# EAGLE design pmu (EAGLE 7.1.0)
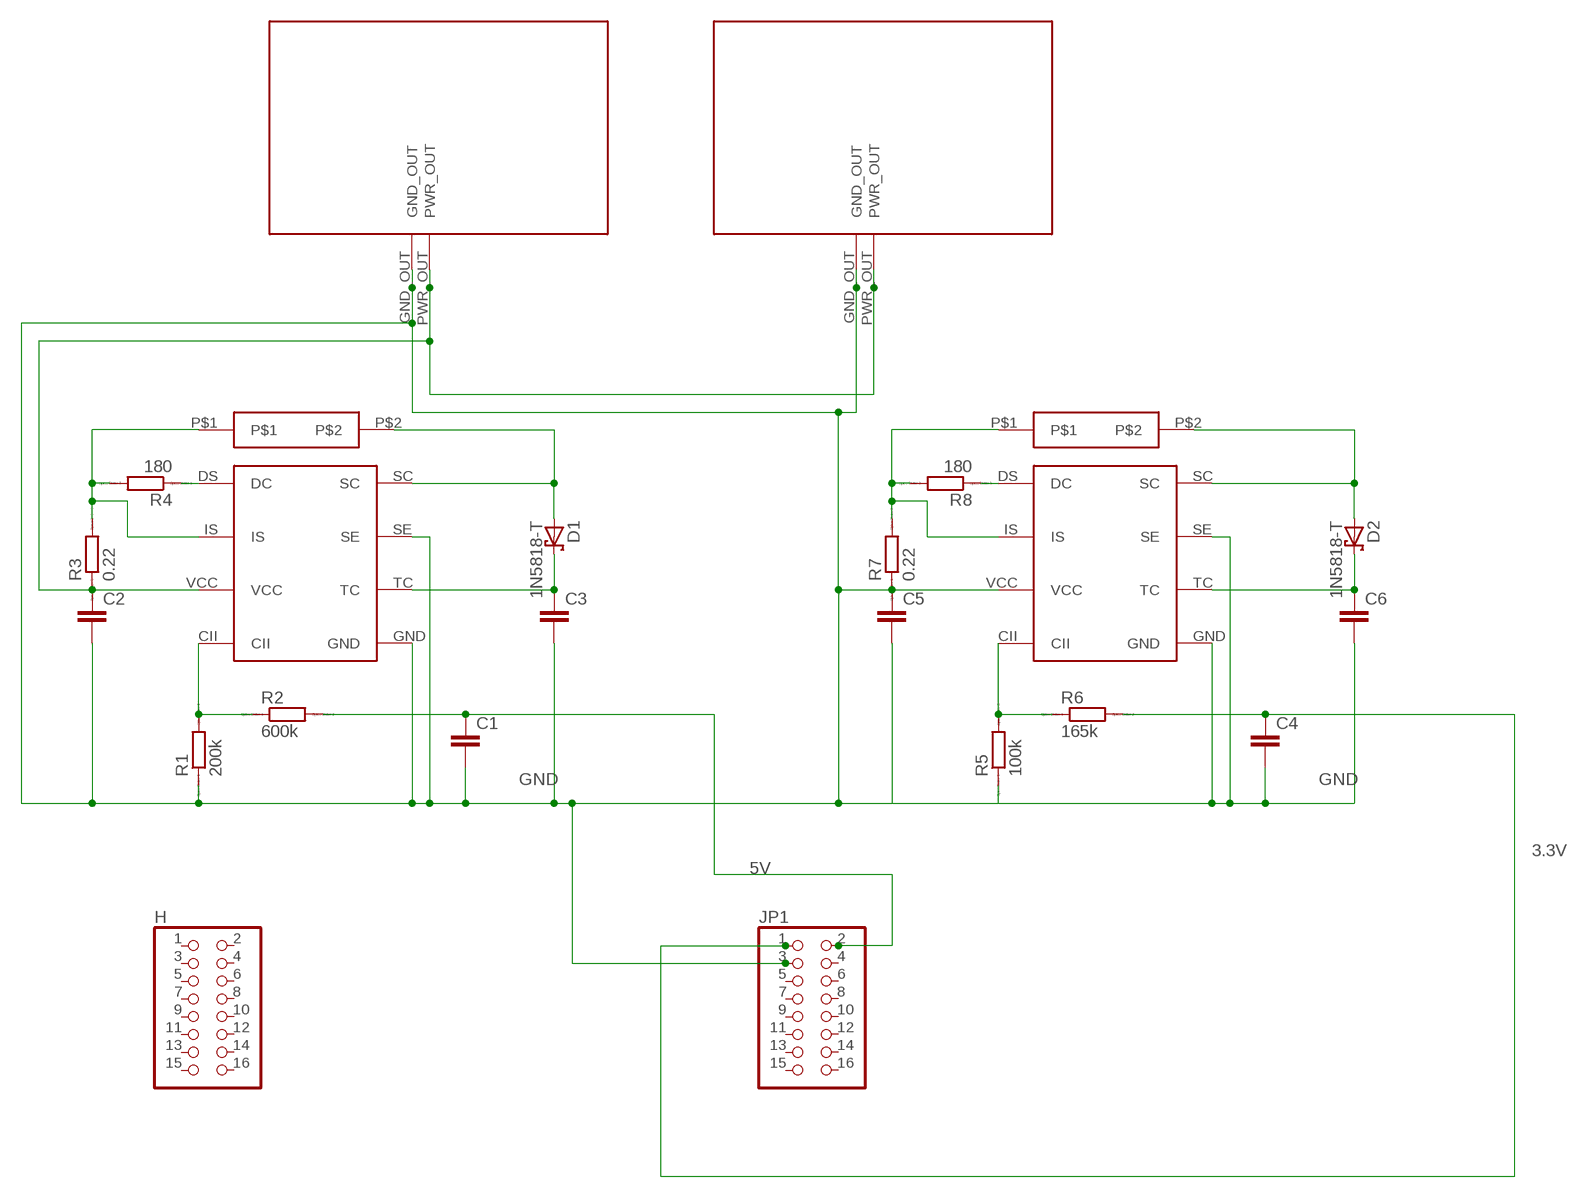
[diagram p0: schematic, sheet 1]

## Parts
C1  C2.5/6  [C2.5-6]
C2  C2.5/6  [C2.5-6]
C3  C2.5/6  [C2.5-6]
C4  C2.5/6  [C2.5-6]
C5  C2.5/6  [C2.5-6]
C6  C2.5/6  [C2.5-6]
D1  1N5818-T  [DO41-7.6]
D2  1N5818-T  [DO41-7.6]
H  PINHD-2X8  [2X08]
JP1  PINHD-2X8  [2X08]
R1  200k  R-EU_0207_12  [0207/12]
R2  600k  R-EU_0207_12  [0207/12]
R3  0.22  R-EU_0207_12  [0207/12]
R4  180  R-EU_0207_12  [0207/12]
R5  100k  R-EU_0207_12  [0207/12]
R6  165k  R-EU_0207_12  [0207/12]
R7  0.22  R-EU_0207_12  [0207/12]
R8  180  R-EU_0207_12  [0207/12]
U$1  CHAR  [CHAR]
U$2  CHAR  [CHAR]
U$3  TIBB  [TIBB]
U$4  IND  [8RHT2]
U$5  TIBB  [TIBB]
U$6  IND  [8RHT2]

## Nets
3.3V: C4.1 JP1.1 R6.2
5V: C1.1 JP1.2 R2.2
GND: C1.2 C2.2 C3.2 C4.2 C5.1 C5.2 C6.2 JP1.3 R1.1 R5.1 R7.1 U$1.GND_OUT U$2.GND_OUT U$3.GND U$3.SE U$5.GND U$5.SE U$5.VCC
N$1: D1.A U$3.SC U$4.P$2
N$2: C2.1 R3.1 U$1.PWR_OUT U$2.PWR_OUT U$3.VCC
N$3: R1.2 R2.1 U$3.CII
N$5: R4.1 U$3.DS(DC)
N$6: C3.1 D1.C U$3.TC
N$8: R5.2 R6.1 U$5.CII
N$9: R3.2 R4.2 U$3.IS U$4.P$1
N$12: R7.2 R8.2 U$5.IS U$6.P$1
N$14: R8.1 U$5.DS(DC)
N$15: D2.A U$5.SC U$6.P$2
N$16: C6.1 D2.C U$5.TC
Unconnected: H.1 H.2 H.3 H.4 H.5 H.6 H.7 H.8 H.9 H.10 H.11 H.12 H.13 H.14 H.15 H.16 JP1.4 JP1.5 JP1.6 JP1.7 JP1.8 JP1.9 JP1.10 JP1.11 JP1.12 JP1.13 JP1.14 JP1.15 JP1.16

## Library data of the parts
C1-C6 = capacitor-wima:C: CAPACITOR naming: grid - package width
D1 D2 = diode:1N581*: 1.0A SCHOTTKY BARRIER RECTIFIER Source: http://www.diodes.com/datasheets/ds23001.pdf
H JP1 = pinhead:PINHD-2X8: PIN HEADER
R1-R8 = resistor:R-EU_: RESISTOR, European symbol; SPICEPREFIX: R
U$1 U$2 = charger:CHAR
U$3 U$5 = tibb:TIBB
U$4 U$6 = ind:IND

## Board
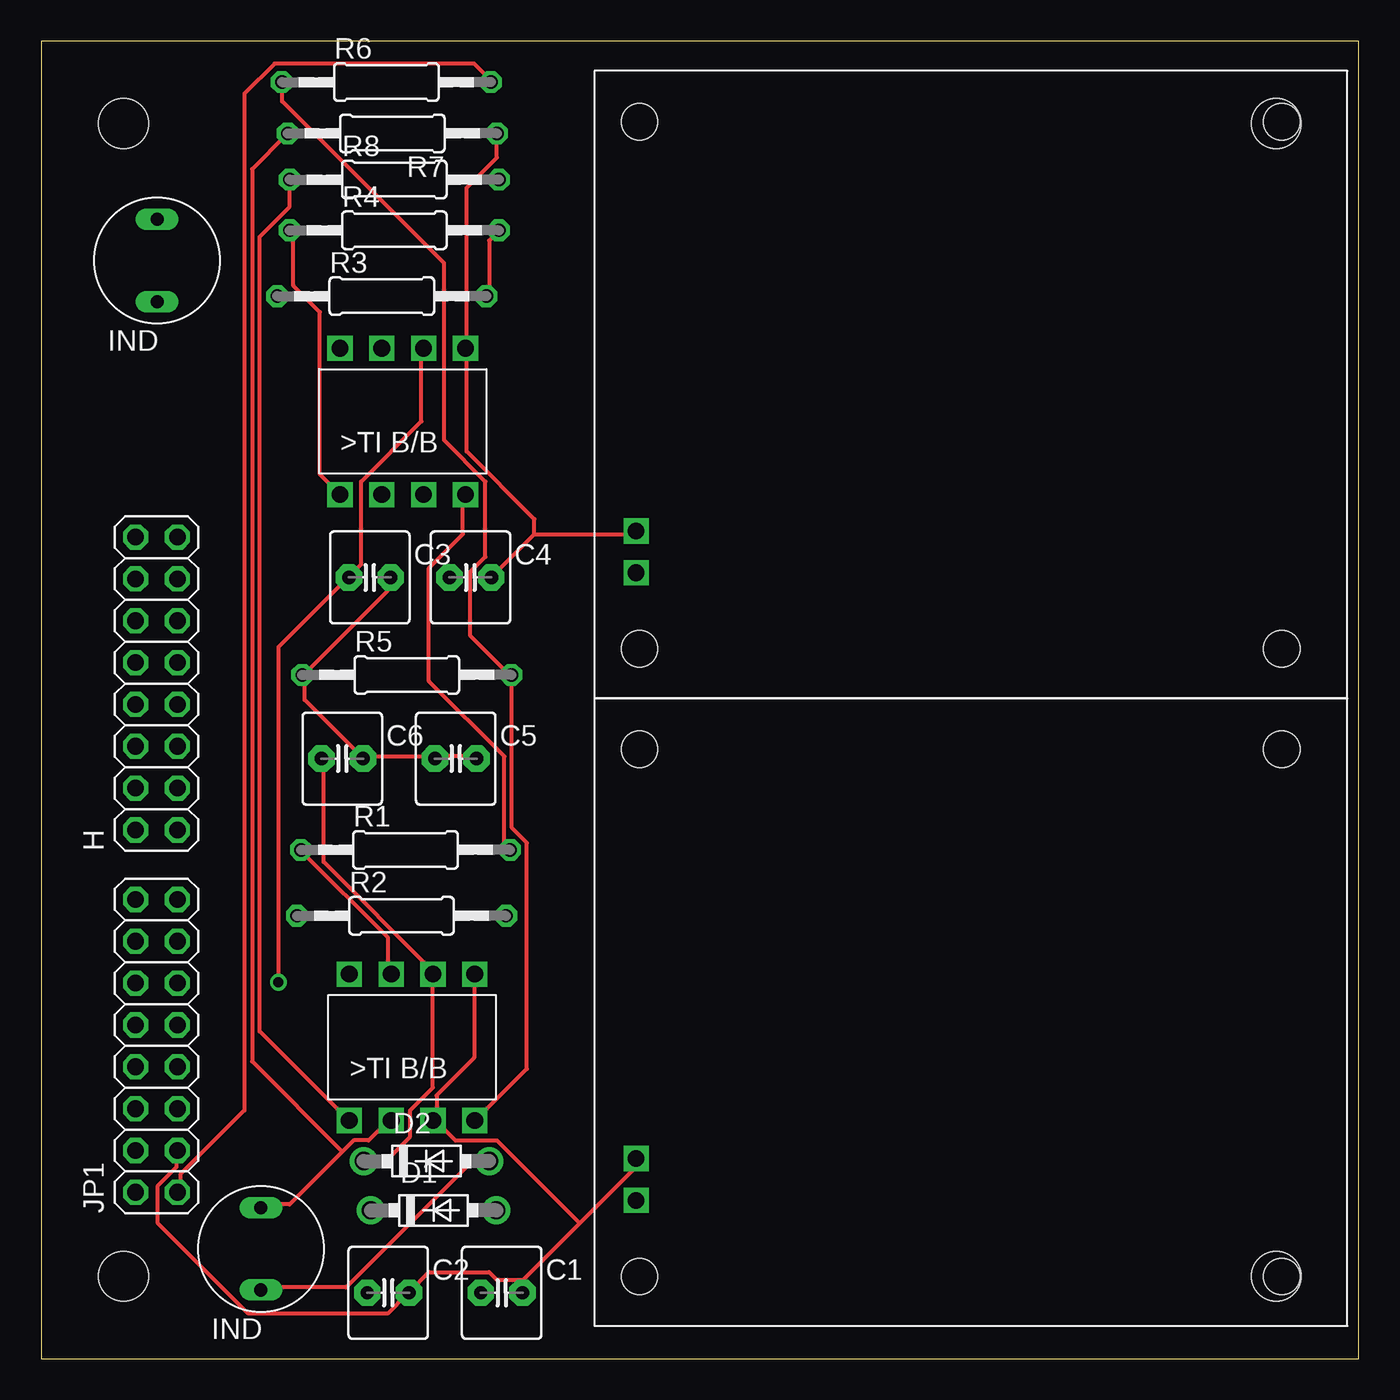
[diagram p1: board, top side]
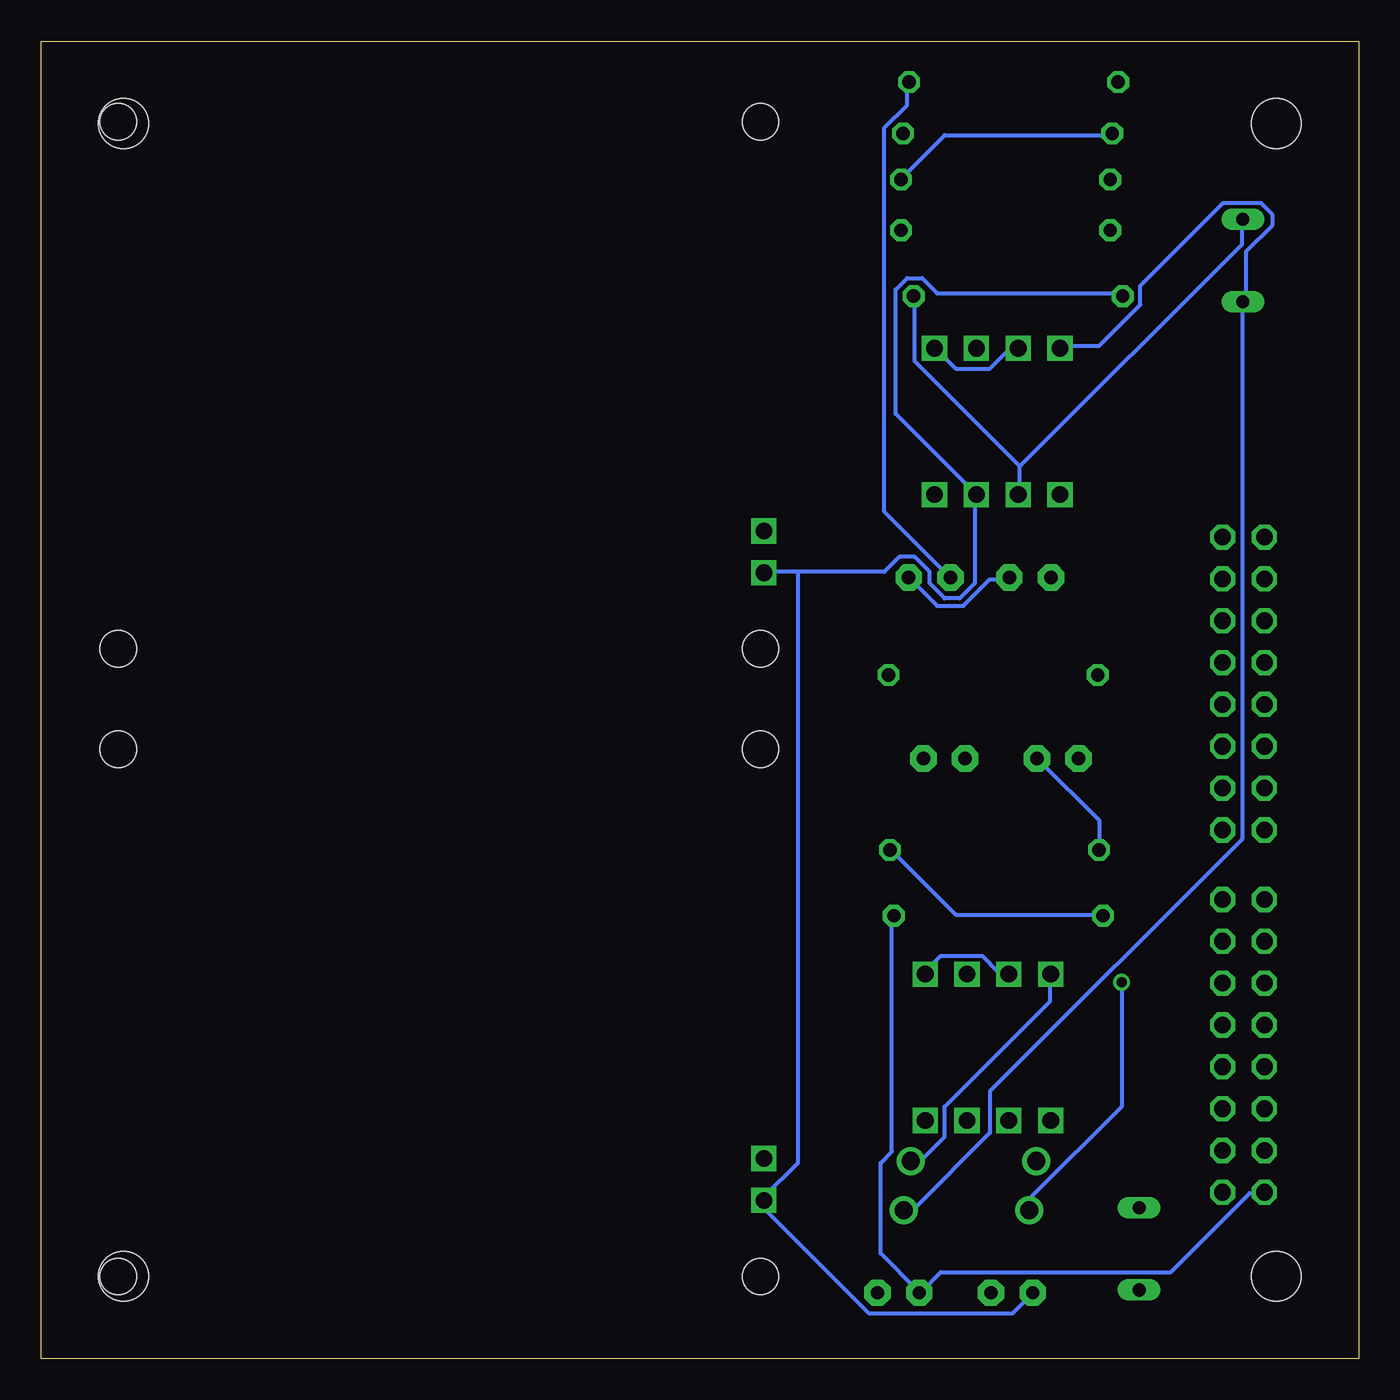
[diagram p2: board, bottom side, seen from below]

Size 80 x 80 mm. Coordinates in mm from the lower left corner, seen from the top.
Outline: 0,0 80,0 80,80 0,80 0,0
Copper layers (1*16): Top 0.035mm / dielectric 1.5mm / Bottom 0.035mm
Design rules "default": minimum track width 10mil, minimum drill 24mil, track to track 8mil, track to pad 8mil, pad to pad 8mil, via to via 8mil, smd to smd 8mil, copper to edge 40mil, drill to drill 8mil, minimum pad ring 10mil, minimum via ring 8mil, stop-mask expansion 4mil, vias tented up to drill 0mil, thermal gap 10mil
Holes 3 mm at 5,75 75,75 75,5 5,5

### Footprints (pad centres in the part's own frame; a part is rotated, then mirrored left to right if it is on the bottom)
C2.5-6 = drill 0.813 pad 1.6 octagon: 1 -1.27,0; 2 1.27,0
DO41-7.6 = drill 1.1 pad 1.7: A 3.81,0; C -3.81,0
2X08 = drill 1.016 octagon: 1 -8.89,-1.27; 2 -8.89,1.27; 3 -6.35,-1.27; 4 -6.35,1.27; 5 -3.81,-1.27; 6 -3.81,1.27; 7 -1.27,-1.27; 8 -1.27,1.27; 9 1.27,-1.27; 10 1.27,1.27; 11 3.81,-1.27; 12 3.81,1.27; 13 6.35,-1.27; 14 6.35,1.27; 15 8.89,-1.27; 16 8.89,1.27
0207/12 = drill 0.813 octagon: 1 -6.35,0; 2 6.35,0
CHAR = drill 1.016 square: GND_OUT -24.13,-1.27; PWR_OUT -24.13,-3.81 | hole 2.2: -23.924,23.57; -23.924,-8.43; 15.076,-8.43; 15.076,23.57
TIBB = drill 1.016 square: CII 5.08,-5.08; DS -2.54,-5.08; GND 5.08,3.81; IS 0,-5.08; SC -2.54,3.81; SE 0,3.81; TC 2.54,3.81; VCC 2.54,-5.08
8RHT2 = drill 0.8 long: P$1 -5,4; P$2 -5,-1

### Placement (x,y rotation side)
C1  27.96,4.01 0 top
C2  21.07,4.01 0 top
C3  19.95,47.44 0 top
C4  26.06,47.44 0 top
C5  25.17,36.44 0 top
C6  18.28,36.44 0 top
D1  23.82,9.01 0 top
D2  23.39,12.01 0 top
H  7,41 90 top
JP1  7,19 90 top
R1  22.12,30.9 0 top
R2  21.88,26.9 0 top
R3  20.68,64.52 0 top
R4  21.44,68.52 0 top
R5  22.2,41.52 0 top
R6  20.96,77.52 0 top
R7  21.32,74.4 180 top
R8  21.44,71.6 0 top
U$1  60.25,13.43 0 top
U$2  60.25,51.53 0 top
U$3  20.68,57.55 0 top
U$4  12.04,65.18 0 top
U$5  21.25,19.55 0 top
U$6  18.34,5.18 0 top

### Tracks (layer width: path | path; a pad name or v marks a point on that pad's centre or on a via)
3.3V
  Top 0.254: JP1.1 8.46,10.29 8.46,11.2 12.34,15.09 12.34,76.81 14.17,78.64 26.29,78.64 27.2,77.72 R6.2
  Bottom 0.254: R6.2 27.43,77.5 27.43,76.12 28.8,74.75 28.8,51.44 24.92,47.55 C4.1
5V
  Bottom 0.254: R2.2 28.35,26.75 28.35,12.57 29.03,11.89 29.03,6.4 26.75,4.12 C1.1 26.52,4.12 25.38,5.26 11.43,5.26 6.63,10.06 5.94,10.06 JP1.2
GND
  Top 0.254: 29.26,4.8 32.69,8.23 | 32.69,8.23 36.12,11.66 36.12,12.12 U$1.GND_OUT | 29.26,4.8 29.26,4.12 C1.2 29.26,4.8 | JP1.3 8.23,12.57 8.23,11.66 7.09,10.52 7.09,8.23 12.57,2.74 21.03,2.74 22.17,3.89 C2.2 22.4,4.12 23.55,5.26 27.2,5.26 27.66,4.8 29.26,4.8 | R7.1 27.66,74.3 27.66,72.92 25.83,71.09 25.83,61.49 U$3.GND 25.83,61.27 25.83,55.09 29.95,50.98 29.95,50.06 | 29.95,50.06 36.12,50.06 U$2.GND_OUT | 29.95,50.06 27.43,47.55 C4.2 | U$5.GND 26.29,23.32 26.29,18.29 24,16 24,14.63 U$5.VCC 24,14.4 25.15,13.26 27.66,13.26 32.69,8.23 | C5.2 26.29,36.58 24,36.58 C5.1 23.77,36.58 19.66,36.58 C6.2 19.43,36.58 16,40.01 16,41.38 R5.1 16,41.6 21.03,46.63 21.03,47.32 C3.2 | U$5.SE 21.03,23.55 21.03,25.6 15.77,30.86 R1.1
  Bottom 0.254: U$3.SE 20.8,61.27 21.26,61.27 22.4,60.12 24.46,60.12 25.6,61.27 U$3.GND | C3.2 21.26,47.32 22.4,47.32 24,45.72 25.6,45.72 27.2,47.32 C4.2 | U$5.SE 21.26,23.55 21.95,23.55 22.86,24.46 25.38,24.46 26.29,23.55 U$5.GND | R1.1 15.77,31.09 15.77,32.69 19.43,36.35 C6.2
N$1
  Bottom 0.254: U$3.SC 18.06,61.49 15.77,61.49 13.26,64.01 13.26,65.15 8.23,70.18 5.94,70.18 5.26,69.49 5.26,68.81 6.86,67.21 6.86,64.24 U$4.P$2 7.09,64.01 7.09,31.55 22.4,16.23 22.4,13.72 26.98,9.14 27.43,9.14 D1.A
N$2
  Bottom 0.254: C2.1 19.89,3.89 21.03,2.74 29.72,2.74 36.12,9.14 36.12,9.6 U$1.PWR_OUT 36.12,9.83 34.06,11.89 34.06,47.78 | R3.1 14.4,64.69 25.6,64.69 26.52,65.61 27.43,65.61 28.12,64.92 28.12,57.38 23.32,52.58 U$3.VCC 23.32,52.35 23.32,47.09 24.23,46.18 25.15,46.18 26.06,47.09 26.06,47.78 26.98,48.69 27.89,48.69 28.8,47.78 34.06,47.78 | 34.06,47.78 36.12,47.78 U$2.PWR_OUT
N$3
  Top 0.254: U$3.CII 25.6,52.35 25.6,50.06 23.55,48.01 23.55,41.15 28.12,36.58 28.12,31.32 28.35,31.09 R1.2
  Bottom 0.254: R2.1 15.54,26.98 24.46,26.98 28.35,30.86 R1.2
N$5
  Top 0.254: R4.1 15.32,68.35 15.32,65.15 16.92,63.55 16.92,53.72 18.06,52.58 U$3.DS
N$6  (via drill 0.61)
  Top 0.254: U$3.TC 23.09,61.27 23.09,56.92 19.43,53.26 19.43,48.23 18.75,47.55 C3.1 18.52,47.32 14.4,43.2 v14.4,22.86
  Bottom 0.254: v14.4,22.86 14.4,15.32 19.89,9.83 19.89,9.14 D1.C
N$8
  Top 0.254: U$5.CII 26.52,14.63 29.49,17.6 29.49,31.32 28.57,32.23 28.57,41.38 R5.2 28.35,41.6 26.06,43.89 26.06,47.78 26.98,48.69 26.98,53.26 24.46,55.78 24.46,66.52 14.63,76.35 14.63,77.5 R6.1
N$9
  Top 0.254: R3.2 27.2,64.69 27.2,67.89 27.66,68.35 R4.2
  Bottom 0.254: 20.57,54.18 7.09,67.67 7.09,69.04 U$4.P$1 | 20.57,54.18 20.57,52.58 U$3.IS | 20.57,54.18 26.98,60.58 26.98,64.47 R3.2
N$12
  Top 0.254: 18.29,12.57 18.97,13.26 19.89,13.26 21.03,14.4 U$5.IS | 18.29,12.57 15.09,9.37 13.49,9.37 U$6.P$1 | 18.29,12.57 12.8,18.06 12.8,72.24 14.86,74.3 R7.2
  Bottom 0.254: R7.2 15.09,74.3 25.15,74.3 27.66,71.78 R8.2
N$14
  Top 0.254: R8.1 15.09,71.55 15.09,69.95 13.26,68.12 13.26,19.89 18.52,14.63 U$5.DS
N$15
  Top 0.254: U$6.P$2 13.49,4.34 18.52,4.34 26.06,11.89 26.98,11.89 D2.A
  Bottom 0.254: U$5.SC 18.75,23.32 18.75,21.72 25.15,15.32 25.15,13.49 26.52,12.12 26.98,12.12 D2.A
N$16
  Top 0.254: D2.C 19.66,12.12 21.03,12.12 22.4,13.49 22.4,15.09 23.77,16.46 23.77,23.32 U$5.TC 23.77,23.55 17.14,30.18 17.14,36.35 C6.1